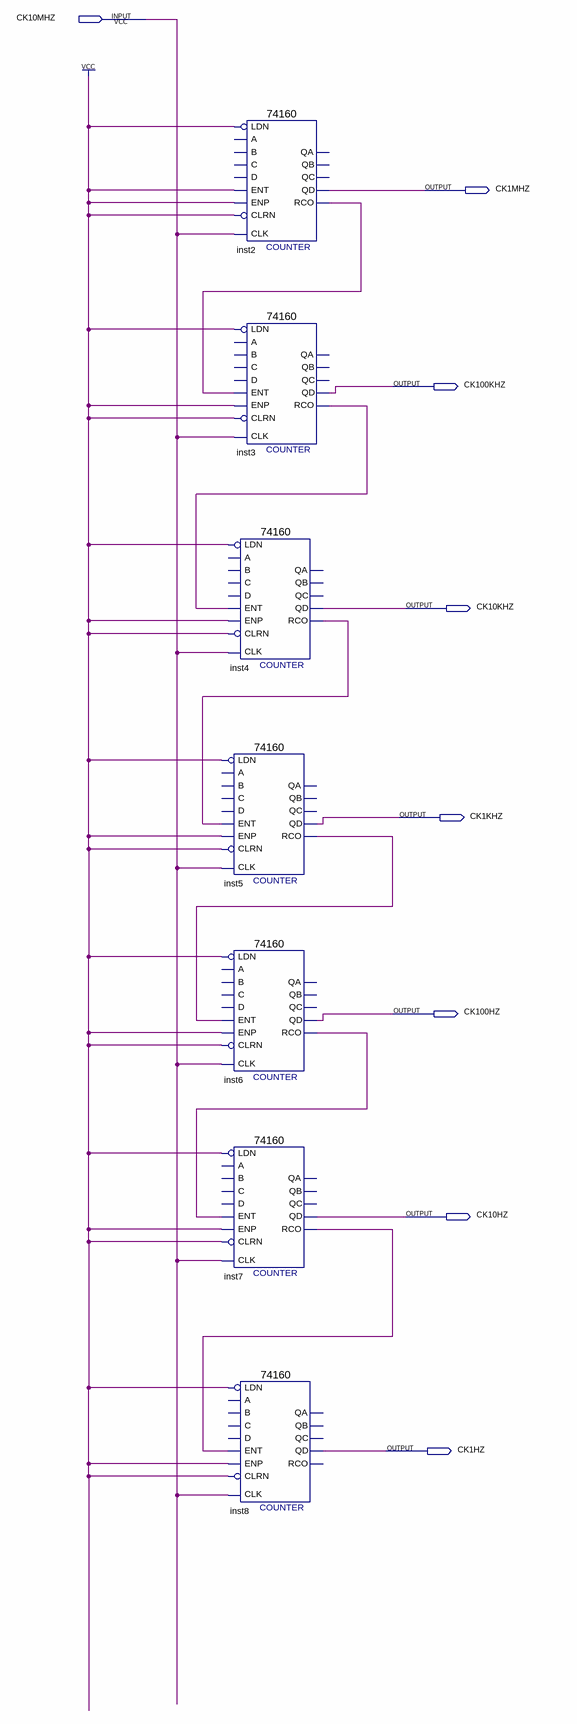
[diagram p0: schematic sheet]
// Quartus schematic divisor_clock.bdf as structural Verilog: 7 symbols, 8 pins
module divisor_clock (
  input  CK10MHZ,
  output CK1MHZ,
  output CK100KHZ,
  output CK10KHZ,
  output CK1KHZ,
  output CK100HZ,
  output CK10HZ,
  output CK1HZ
);

  wire inst2_rco, inst3_rco, inst4_rco, inst5_rco, inst6_rco, inst7_rco;

  \74160  inst2 (
    .CLK(CK10MHZ), .ENT(1'b1), .LDN(1'b1), .ENP(1'b1), .CLRN(1'b1), .QD(CK1MHZ), .RCO(inst2_rco));  // open: A, B, C, D, QA, QB, QC
  \74160  inst3 (
    .CLK(CK10MHZ), .ENT(inst2_rco), .LDN(1'b1), .ENP(1'b1), .CLRN(1'b1), .QD(CK100KHZ), .RCO(inst3_rco));  // open: A, B, C, D, QA, QB, QC
  \74160  inst4 (
    .CLK(CK10MHZ), .ENT(inst3_rco), .LDN(1'b1), .ENP(1'b1), .CLRN(1'b1), .QD(CK10KHZ), .RCO(inst4_rco));  // open: A, B, C, D, QA, QB, QC
  \74160  inst5 (
    .CLK(CK10MHZ), .ENT(inst4_rco), .LDN(1'b1), .ENP(1'b1), .CLRN(1'b1), .QD(CK1KHZ), .RCO(inst5_rco));  // open: A, B, C, D, QA, QB, QC
  \74160  inst6 (
    .CLK(CK10MHZ), .ENT(inst5_rco), .LDN(1'b1), .ENP(1'b1), .CLRN(1'b1), .QD(CK100HZ), .RCO(inst6_rco));  // open: A, B, C, D, QA, QB, QC
  \74160  inst7 (
    .CLK(CK10MHZ), .ENT(inst6_rco), .LDN(1'b1), .ENP(1'b1), .CLRN(1'b1), .QD(CK10HZ), .RCO(inst7_rco));  // open: A, B, C, D, QA, QB, QC
  \74160  inst8 (
    .CLK(CK10MHZ), .ENT(inst7_rco), .LDN(1'b1), .ENP(1'b1), .CLRN(1'b1), .QD(CK1HZ));  // open: A, B, C, D, QA, QB, QC, RCO
endmodule
